# EAGLE schematic Subscale_Datalogger_no_cutdown_shown (EAGLE 9.1.3)
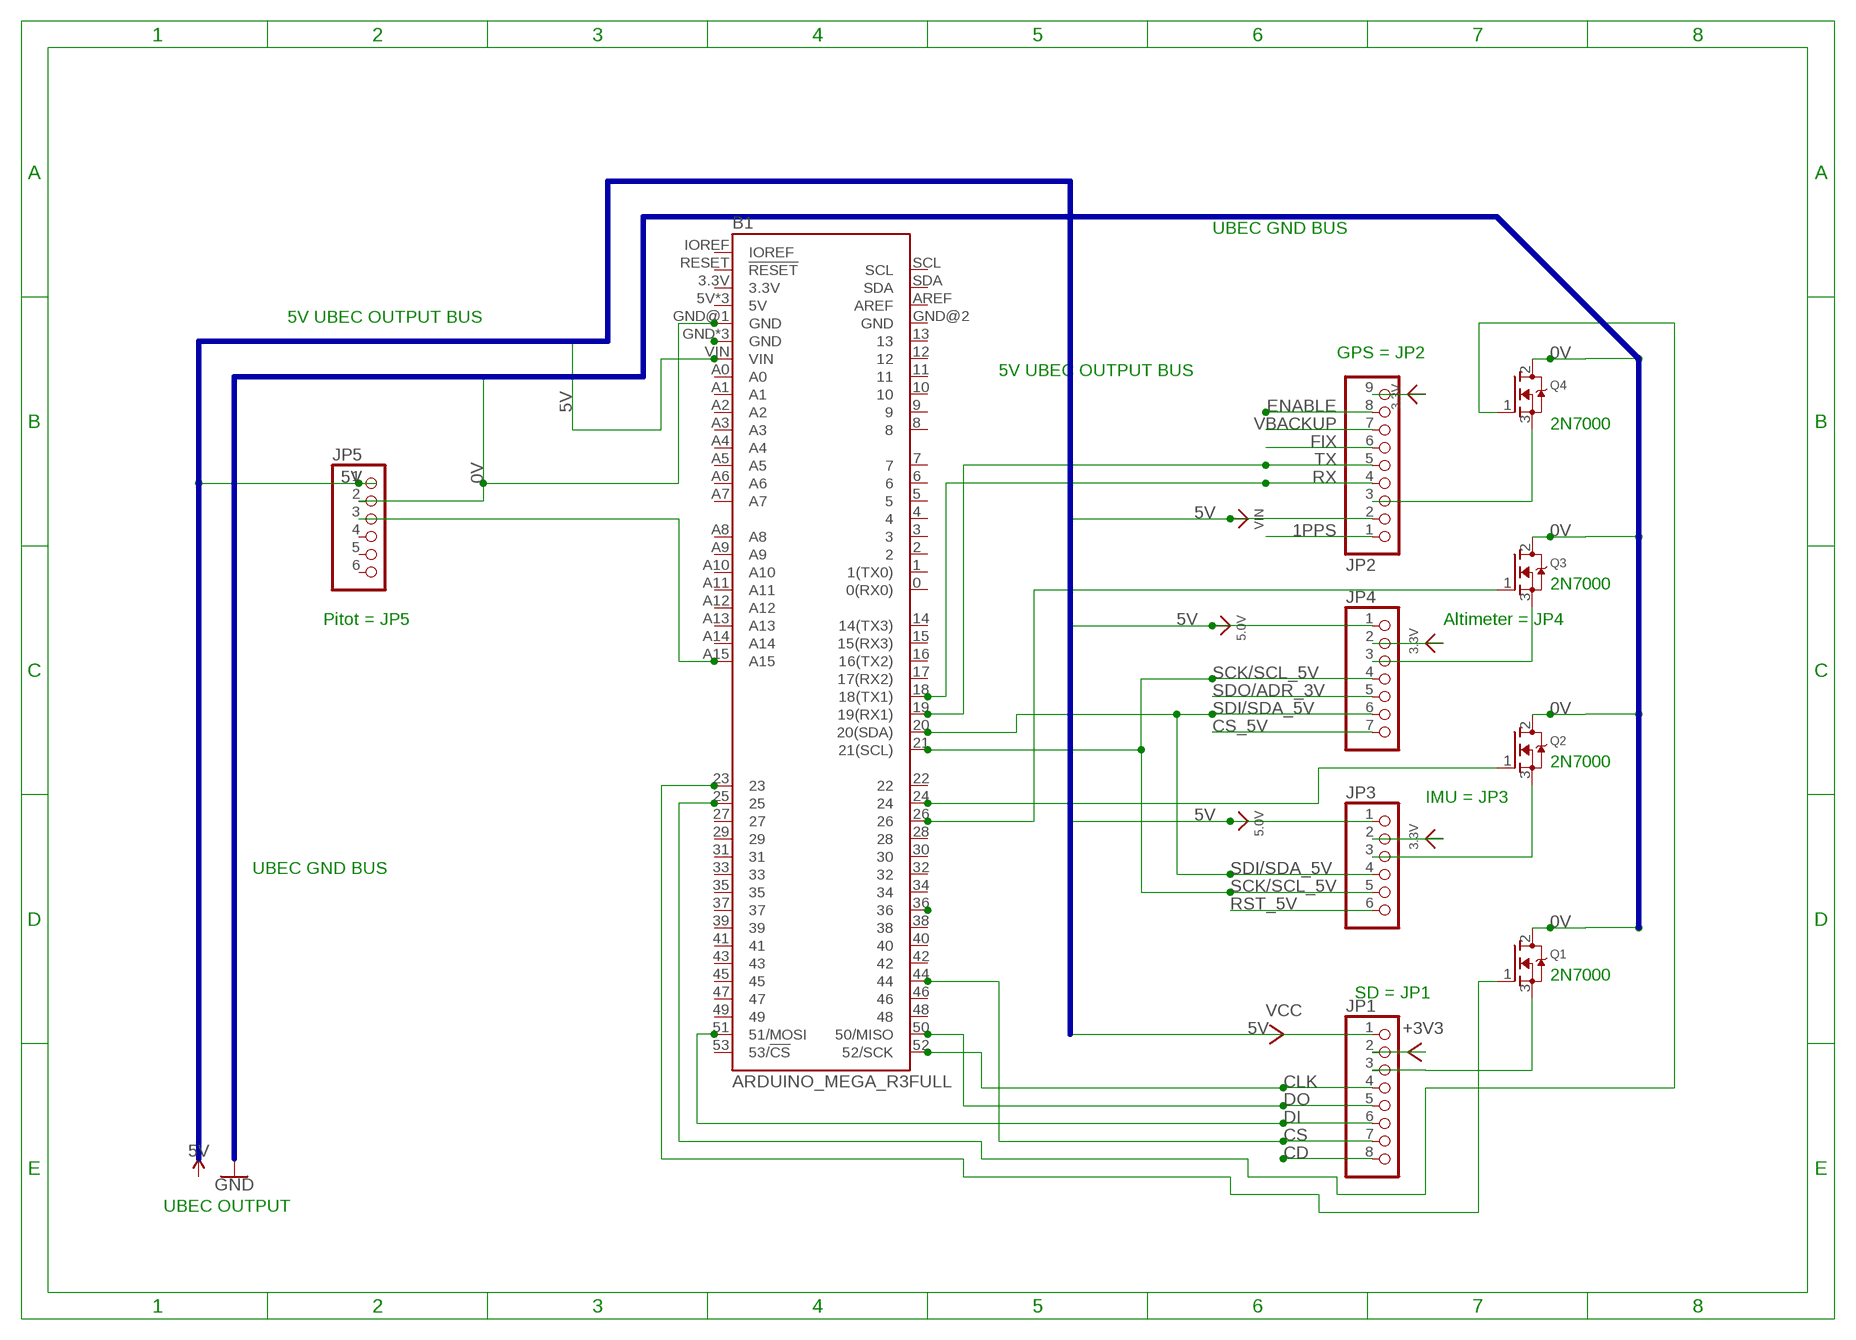
[diagram p0: schematic, sheet 1]

## Parts
B1  ARDUINO_MEGA_R3FULL  [ARDUINO_MEGA_NO_SILK]
JP1  PINHD-1X8BIG  [1X08-BIG]
JP2  HEADER-1X970MIL  [1X09_ROUND_70]
JP3  HEADER-1X676MIL  [1X06_ROUND_76]
JP4  HEADER-1X770MIL  [1X07_ROUND_70]
JP5  HEADER-1X676MIL  [1X06_ROUND_76]
Q1  MOSFET-NGDS_TO220V  [TO220V]
Q2  MOSFET-NGDS_TO220V  [TO220V]
Q3  MOSFET-NGDS_TO220V  [TO220V]
Q4  MOSFET-NGDS_TO220V  [TO220V]

## Nets
0V: B1.GND@1(GND) JP5.2 Q1.2(D) Q2.2(D) Q3.2(D) Q4.2(D)
1PPS: JP2.1
3.3V: JP2.9 JP3.2 JP4.2
5.0V: JP3.1 JP4.1
5V: B1.VIN JP5.1
+3V3: JP1.2
CD: JP1.8
CLK: B1.52(52/SCK) JP1.4
CS: B1.44 JP1.7
CS_5V: JP4.7
DI: B1.51(51/MOSI) JP1.6
DO: B1.50(50/MISO) JP1.5
ENABLE: JP2.8
FIX: JP2.6
N$1: JP3.3
N$3: B1.A15 JP5.3
N$5: B1.GND B1.GND@3(GND) B1.GND@4(GND)
N$14: B1.25 Q4.1(G)
N$15: B1.24 Q2.1(G)
N$16: B1.36
N$17: B1.26 Q3.1(G)
N$18: B1.23 Q1.1(G)
N$19: JP4.3 Q3.3(S)
N$20: JP2.3 Q4.3(S)
N$21: Q2.3(S)
N$22: JP1.3 Q1.3(S)
RST_5V: JP3.6
RX: B1.18(18(TX1)) JP2.4
SCK/SCL_5V: B1.21(21(SCL)) JP3.5 JP4.4
SDI/SDA_5V: B1.20(20(SDA)) JP3.4 JP4.6
SDO/ADR_3V: JP4.5
TX: B1.19(19(RX1)) JP2.5
VBACKUP: JP2.7
VCC: JP1.1
VIN: JP2.2
Unconnected: B1.0(0(RX0)) B1.1(1(TX0)) B1.2 B1.3 B1.3.3V B1.4 B1.5 B1.5V B1.5V@1(5V) B1.5V@2(5V) B1.6 B1.7 B1.8 B1.9 B1.10 B1.11 B1.12 B1.13 B1.14(14(TX3)) B1.15(15(RX3)) B1.16(16(TX2)) B1.17(17(RX2)) B1.22 B1.27 B1.28 B1.29 B1.30 B1.31 B1.32 B1.33 B1.34 B1.35 B1.37 B1.38 B1.39 B1.40 B1.41 B1.42 B1.43 B1.45 B1.46 B1.47 B1.48 B1.49 B1.53(53/!CS) B1.A0 B1.A1 B1.A2 B1.A3 B1.A4 B1.A5 B1.A6 B1.A7 B1.A8 B1.A9 B1.A10 B1.A11 B1.A12 B1.A13 B1.A14 B1.AREF B1.GND@2(GND) B1.IOREF B1.RESET(!RESET) B1.SCL B1.SDA JP5.4 JP5.5 JP5.6

## Buses
UBEC:5V
GND:0V

## Notes on the sheet
- UBEC GND BUS
- 5V UBEC OUTPUT BUS
- GPS = JP2
- 5V UBEC OUTPUT BUS
- 2N7000
- 2N7000
- Pitot = JP5 | Altimeter = JP4
- 2N7000
- IMU = JP3
- UBEC GND BUS
- 2N7000
- SD = JP1
- UBEC OUTPUT

## Library data of the parts
B1 = SparkFun-Boards:ARDUINO_MEGA_R3: Arduino Mega R3 ATmega2560 R3 compatible footprint. SparkFun Products: Arduino Mega 2560 R3 <https://www.sparkfun.com/products/11061>
JP1 = adafruit:PINHD-1X8: PIN HEADER
JP2 = microbuilder:HEADER-1X9: PIN HEADER; SPICEPREFIX: X
JP3 JP5 = microbuilder:HEADER-1X6: PIN HEADER
JP4 = microbuilder:HEADER-1X7: PIN HEADER
Q1-Q4 = adafruit:MOSFET-N: N-Channel Mosfet 2N7002E - 60V 260mA SOT23 [Digikey: 2N7002ET1GOSTR-ND] - REEL BSH103 - 30V 850mA SOT23 [Digikey: 568-5013-1-ND]

## Module GPS
Ports: 

### Library data of the parts